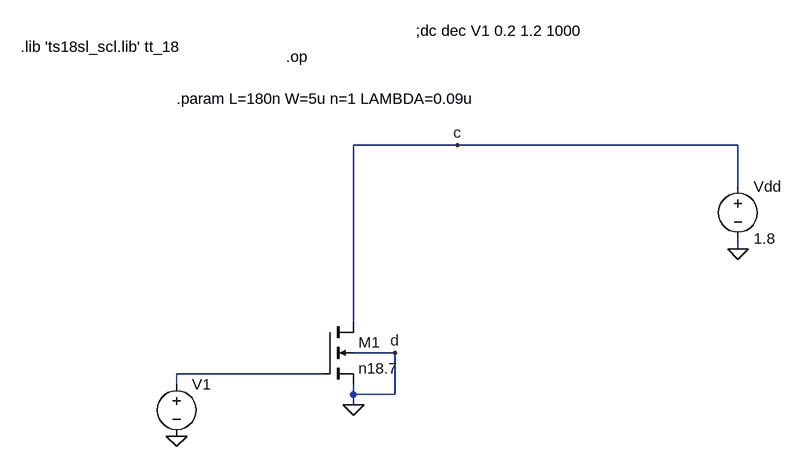
[diagram p0: schematic gm,idvsvgs.asc]
gm,idvsvgs.asc, the LTspice schematic file:
Version 4
SHEET 1 1308 704
WIRE 800 224 640 224
WIRE 1232 224 800 224
WIRE 1232 288 1232 224
WIRE 1232 384 1232 368
WIRE 640 496 640 224
WIRE 704 544 640 544
WIRE 592 576 368 576
WIRE 368 592 368 576
WIRE 640 608 640 592
WIRE 704 608 704 544
WIRE 704 608 640 608
WIRE 640 624 640 608
FLAG 1232 384 0
FLAG 800 224 c
FLAG 640 624 0
FLAG 704 544 d
FLAG 368 672 0
SYMBOL nmos4 592 496 R0
SYMATTR InstName M1
SYMATTR Value n18.7
SYMATTR Value2 l={L} w={W} ad={5*W*LAMBDA} as={5*W*LAMBDA} pd={10*LAMBDA+2*W} ps={10*LAMBDA+2*W}
SYMBOL voltage 1232 272 R0
WINDOW 123 0 0 Left 0
WINDOW 39 0 0 Left 0
SYMATTR InstName Vdd
SYMATTR Value 1.8
SYMBOL voltage 368 576 R0
WINDOW 123 0 0 Left 0
WINDOW 39 0 0 Left 0
SYMATTR InstName V1
SYMATTR Value ""
TEXT 128 72 Left 2 !.lib 'ts18sl_scl.lib' tt_18
TEXT 368 152 Left 2 !.param L=180n W=5u n=1 LAMBDA=0.09u
TEXT 536 88 Left 2 !.op
TEXT 736 48 Left 2 !;dc dec V1 0.2 1.2 1000

The netlist it stands for:
* gm,idvsvgs.asc
M1 c N001 0 0 n18.7 l={L} w={W} ad={5*W*LAMBDA} as={5*W*LAMBDA} pd={10*LAMBDA+2*W} ps={10*LAMBDA+2*W}
Vdd c 0 1.8
V1 N001 0
.model NMOS NMOS
.model PMOS PMOS
.lib standard.mos
.lib 'ts18sl_scl.lib' tt_18
.param L=180n W=5u n=1 LAMBDA=0.09u
.op
;dc dec V1 0.2 1.2 1000
.backanno
.end